# Altium project GenericLedDriver.PrjPcb
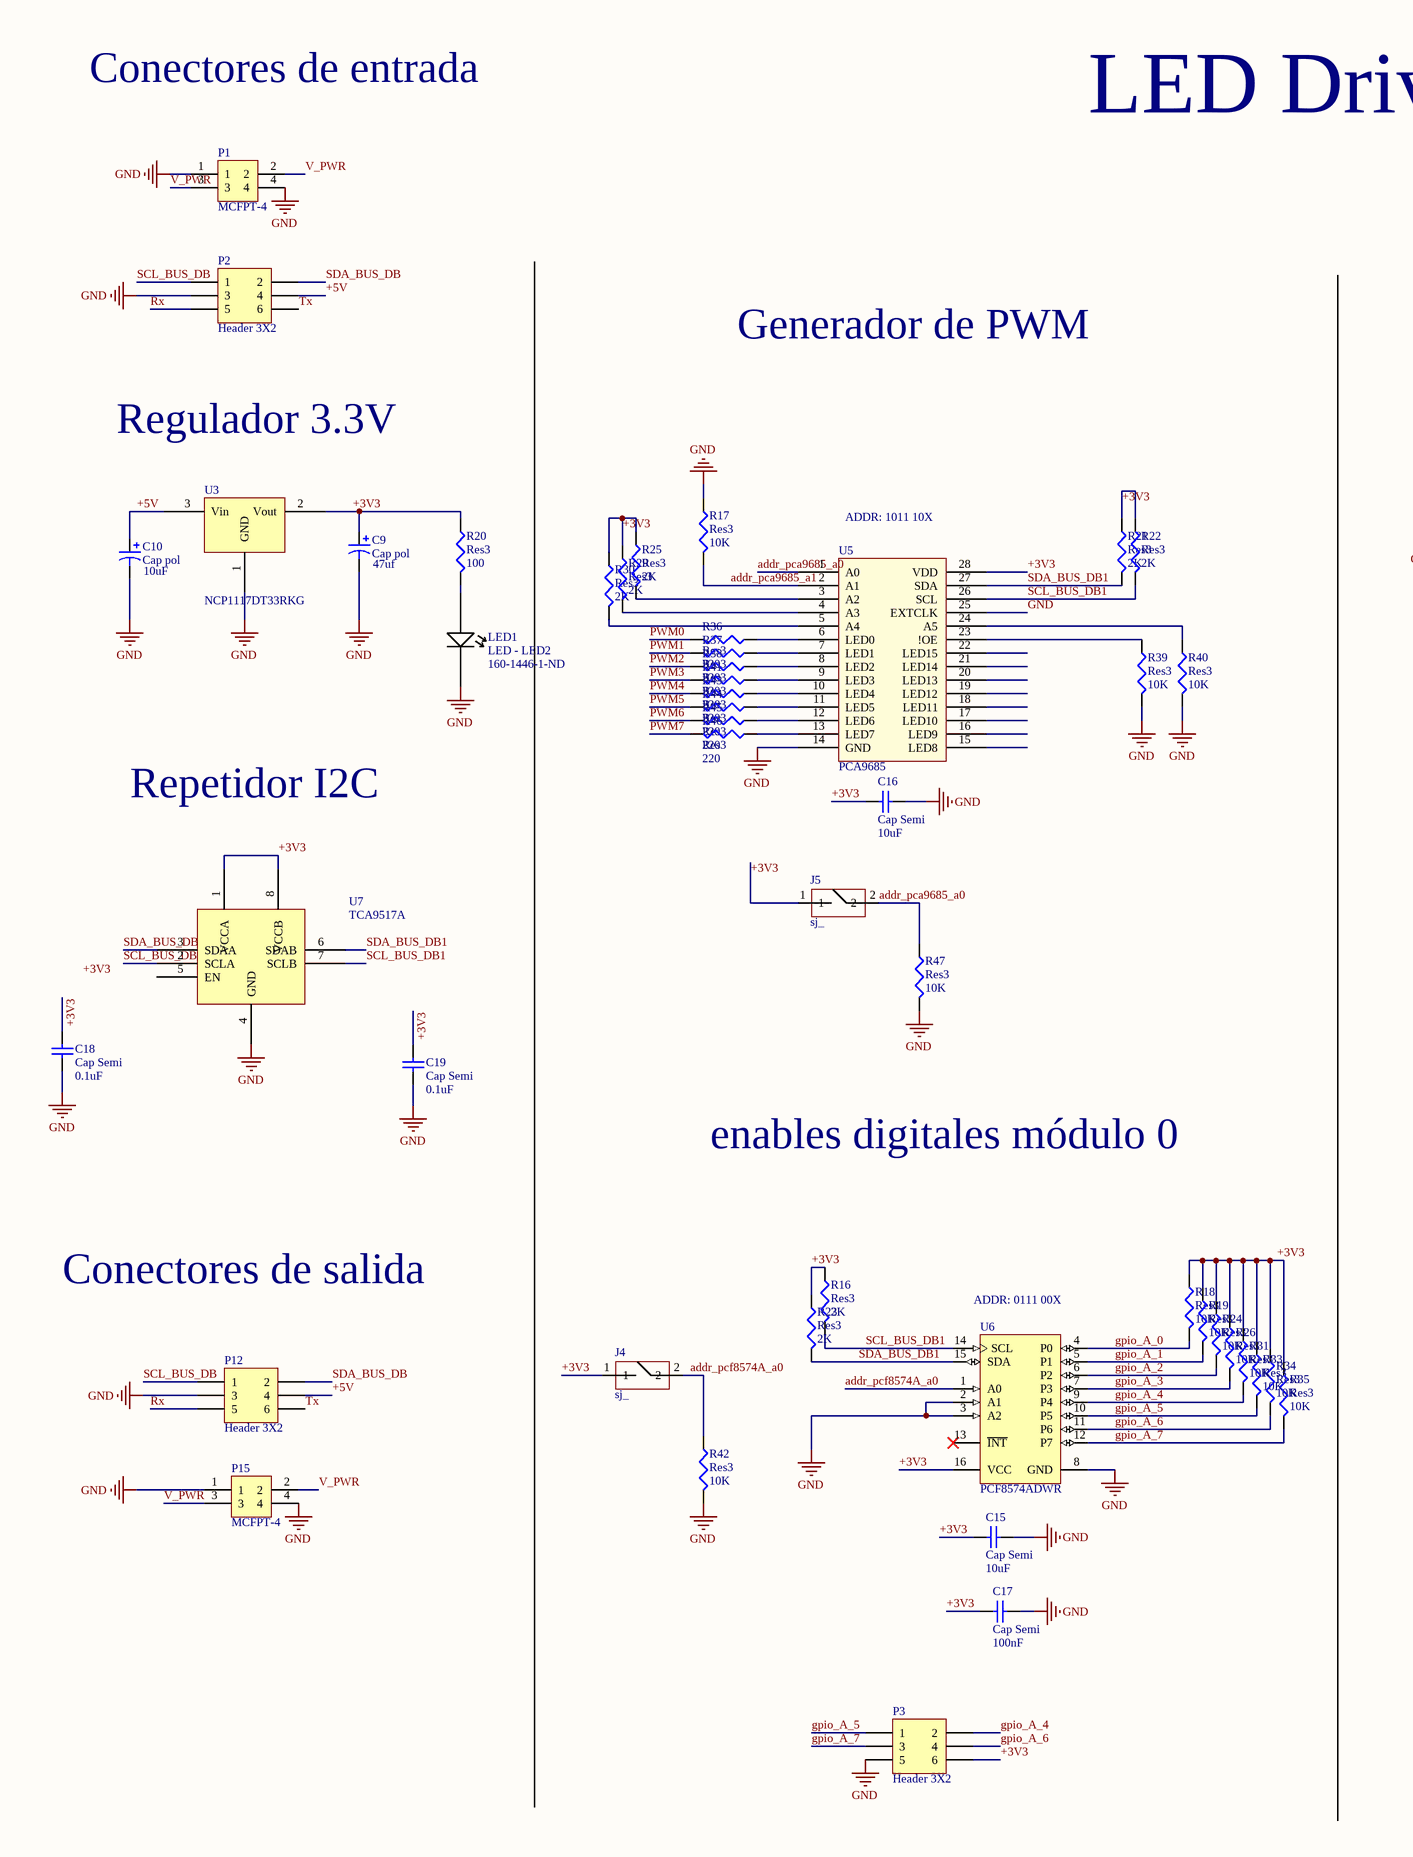
[diagram p0: main.SchDoc, left]
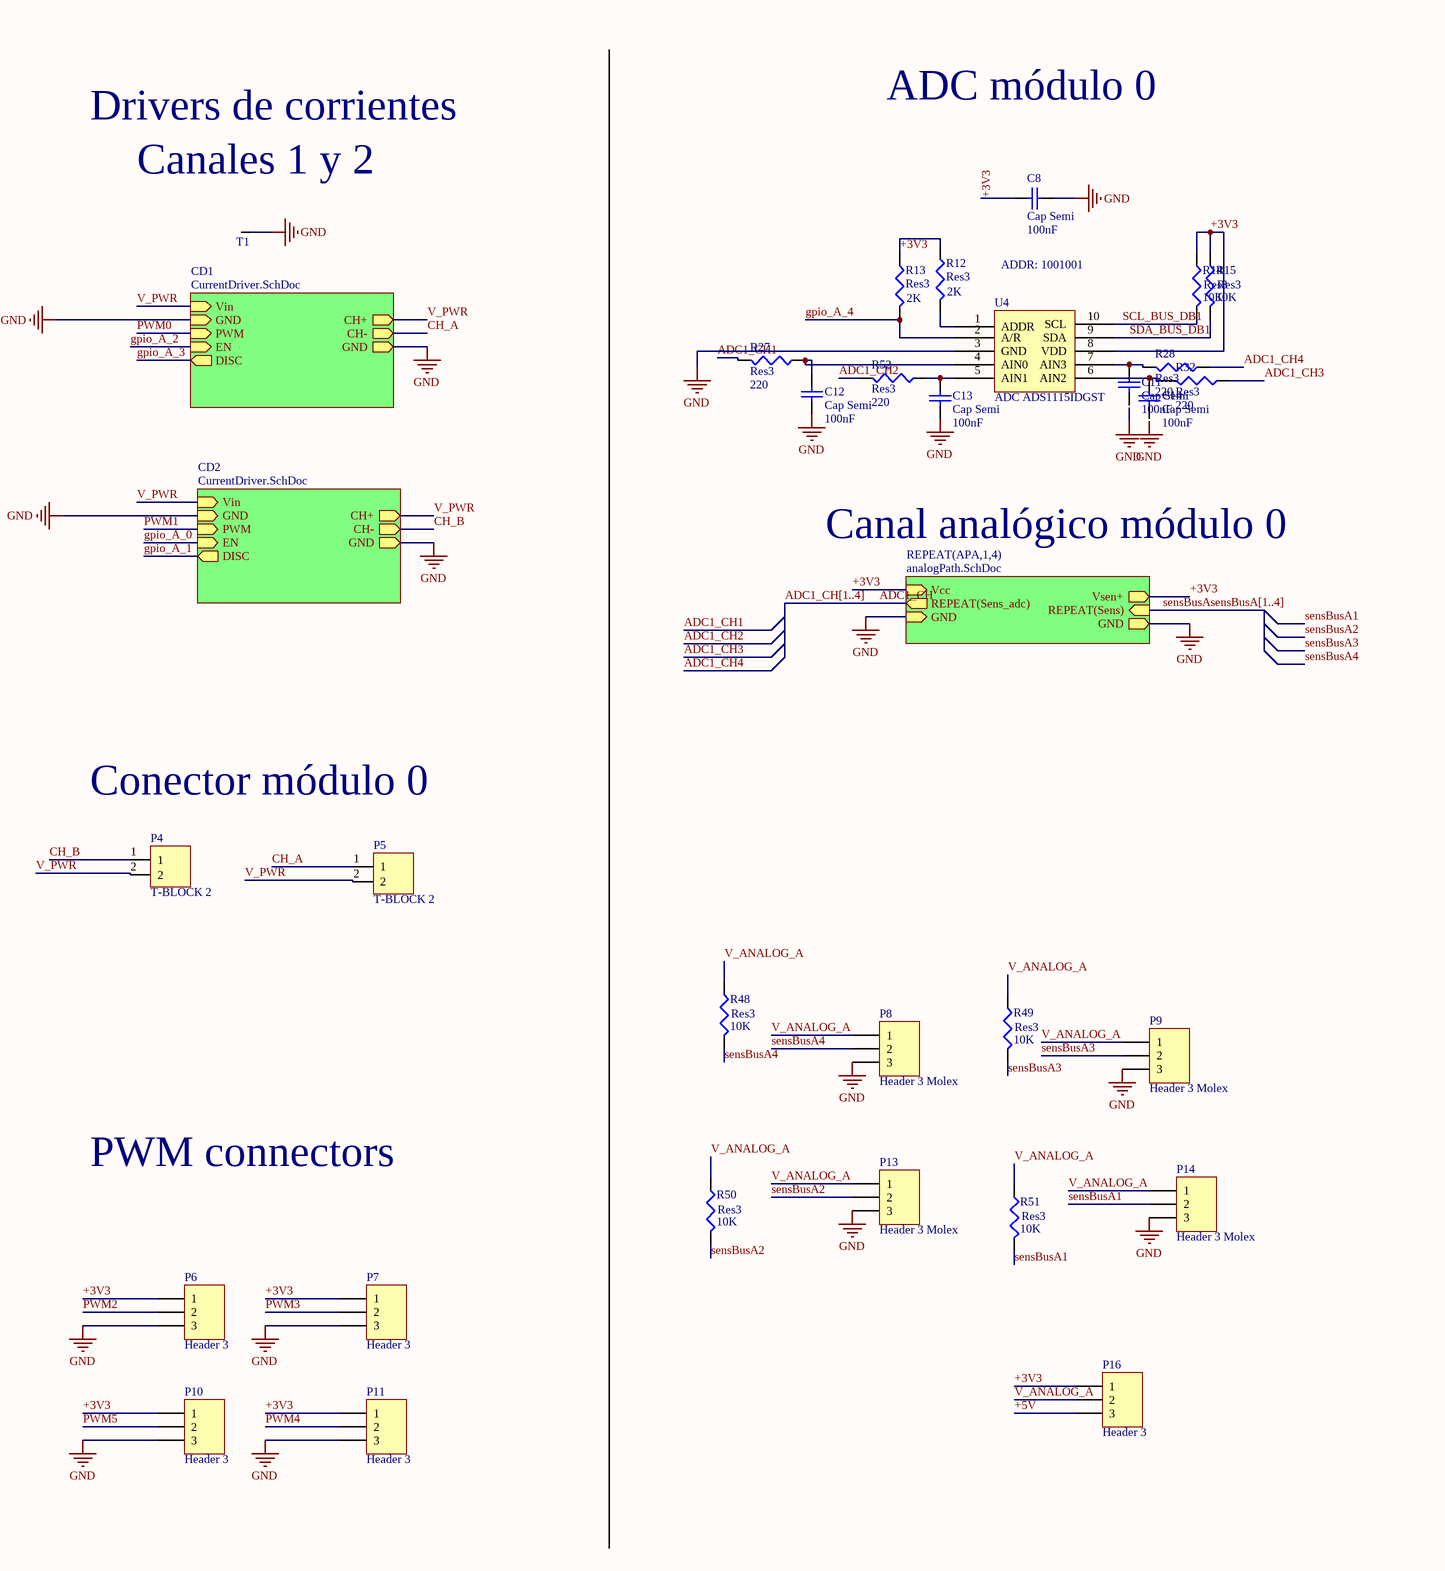
[diagram p1: main.SchDoc, right]
2 sheets, 90 parts. Net scope: hierarchical (ports join the sheet entries above them; power ports are global).
Board file: DriverBlueBoard.PcbDoc
Sheets:
  main.SchDoc
    CD1 = CurrentDriver.SchDoc
    CD2 = CurrentDriver.SchDoc

## Sheet main.SchDoc
size 558 x 381 mm

### Parts
C8  Cap Semi  value 100nF  [1608[0603]]
C9  Cap pol  value 47uf  [CAPEA-5.30x5.30]
C10  Cap pol  value 10uF  [CAPEA-4.30x4.30]
C11  Cap Semi  value 100nF  [1608[0603]]
C12  Cap Semi  value 100nF  [1608[0603]]
C13  Cap Semi  value 100nF  [1608[0603]]
C14  Cap Semi  value 100nF  [1608[0603]]
C15  Cap Semi  value 10uF  [1608[0603]]
C16  Cap Semi  value 10uF  [1608[0603]]
C17  Cap Semi  value 100nF  [1608[0603]]
C18  Cap Semi  value 0.1uF  [1608[0603]]
C19  Cap Semi  value 0.1uF  [1608[0603]]
J4  sj_  [JUMPER_NET_TIE]
J5  sj_  [JUMPER_NET_TIE]
LED1  LED - LED2  Supplier Part Number 1: 160-1446-1-ND  [LED]
P1  MCFPT-4  [MCFPT-4-VERT]
P2  Header 3X2  [HDR2X3]
P3  Header 3X2  [HDR2X3]
P4  T-BLOCK 2  [T-BLOCK_2_3MM]
P5  T-BLOCK 2  [T-BLOCK_2_3MM]
P6  Header 3  [HDR1X3]
P7  Header 3  [HDR1X3]
P8  Header 3 Molex  [HDR1X3]
P9  Header 3 Molex  [HDR1X3]
P10  Header 3  [HDR1X3]
P11  Header 3  [HDR1X3]
P12  Header 3X2  [HDR2X3]
P13  Header 3 Molex  [HDR1X3]
P14  Header 3 Molex  [HDR1X3]
P15  MCFPT-4  [MCFPT-4-VERT]
P16  Header 3  [HDR1X3]
R12  Res3  value 2K  [J1-0603]
R13  Res3  value 2K  [J1-0603]
R14  Res3  value 10K  [J1-0603]
R15  Res3  value 10K  [J1-0603]
R16  Res3  value 2K  [J1-0603]
R17  Res3  value 10K  [J1-0603]
R18  Res3  value 10K  [J1-0603]
R19  Res3  value 10K  [J1-0603]
R20  Res3  value 100  [J1-0603]
R21  Res3  value 2K  [J1-0603]
R22  Res3  value 2K  [J1-0603]
R23  Res3  value 2K  [J1-0603]
R24  Res3  value 10K  [J1-0603]
R25  Res3  value 2K  [J1-0603]
R26  Res3  value 10K  [J1-0603]
R27  Res3  value 220  [J1-0603]
R28  Res3  value 220  [J1-0603]
R29  Res3  value 2K  [J1-0603]
R30  Res3  value 2K  [J1-0603]
R31  Res3  value 10K  [J1-0603]
R32  Res3  value 220  [J1-0603]
R33  Res3  value 10K  [J1-0603]
R34  Res3  value 10K  [J1-0603]
R35  Res3  value 10K  [J1-0603]
R36  Res3  value 220  [J1-0603]
R37  Res3  value 220  [J1-0603]
R38  Res3  value 220  [J1-0603]
R39  Res3  value 10K  [J1-0603]
R40  Res3  value 10K  [J1-0603]
R41  Res3  value 220  [J1-0603]
R42  Res3  value 10K  [J1-0603]
R43  Res3  value 220  [J1-0603]
R44  Res3  value 220  [J1-0603]
R45  Res3  value 220  [J1-0603]
R46  Res3  value 220  [J1-0603]
R47  Res3  value 10K  [J1-0603]
R48  Res3  value 10K  [J1-0603]
R49  Res3  value 10K  [J1-0603]
R50  Res3  value 10K  [J1-0603]
R51  Res3  value 10K  [J1-0603]
R52  Res3  value 220  [J1-0603]
T1  TP - SMALL TP_1  [EXPOSED PAD]  (value not drawn)
U3  NCP1117DT33RKG  [DPAK]
U4  ADC ADS1115IDGST  [DGS10-L]
U5  PCA9685  [SSOP-28_L]
U6  PCF8574ADWR  [DW16_N]
U7  TCA9517A  [vssop-8]

### Sub-sheets
CD1 = CurrentDriver.SchDoc: Vin (in), PWM (in), EN (in), DISC (out), CH+ (out), CH- (out), GND (out), GND (in)
CD2 = CurrentDriver.SchDoc: Vin (in), PWM (in), EN (in), DISC (out), CH+ (out), CH- (out), GND (out), GND (in)
REPEAT(APA,1,4) = analogPath.SchDoc (file not in this document): REPEAT(Sens_adc) (out), Vcc (in), GND (in), Vsen+ (out), REPEAT(Sens) (in), GND (out)

### Nets
GND: C8.1 C9.2 C10.2 C12.2 C13.2 C15.1 C16.1 C17.1 C18.1 C19.1 LED1.2 P1.1 P1.4 P2.3 P3.5 P6.3 P7.3 P8.3 P9.3 P10.3 P11.3 P12.3 P13.3 P14.3 P15.1 P15.4 R17.2 R39.1 R40.1 R42.1 R47.1 T1.1 U3.1(GND) U4.3(GND) U5.14(GND) U5.25(EXTCLK) U6.2(A1) U6.3(A2) U6.8(GND) U7.4(GND) ; sheet CD1/GND, sheet CD1/GND, sheet CD2/GND, sheet CD2/GND, sheet REPEAT(APA,1,4)/GND, sheet REPEAT(APA,1,4)/GND  [project net EXP_PAD]
+3V3: C8.2 C9.1 C15.2 C16.2 C17.2 C18.2 C19.2 J4.1 J5.1 P3.6 P6.1 P7.1 P10.1 P11.1 P16.1 R12.1 R13.1 R14.2 R15.2 R16.1 R18.2 R19.2 R20.2 R21.1 R22.1 R23.1 R24.2 R25.1 R26.2 R29.1 R30.1 R31.2 R33.2 R34.2 R35.2 U3.2(Vout) U4.8(VDD) U5.28(VDD) U6.16(VCC) U7.1(VCCA) U7.8(VCCB) ; sheet REPEAT(APA,1,4)/Vcc, sheet REPEAT(APA,1,4)/Vsen+
+5V: C10.1 P2.4 P12.4 P16.3 U3.3(Vin)
ADC1_CH: sheet REPEAT(APA,1,4)/REPEAT(Sens_adc)
ADC1_CH1: R27.2
ADC1_CH2: R52.2
ADC1_CH3: R32.1
ADC1_CH4: R28.1
addr_pca9685_a0: J5.2 R47.2 U5.1(A0)
addr_pca9685_a1: R17.1 U5.2(A1)
addr_pcf8574A_a0: J4.2 R42.2 U6.1(A0)
CH_A: P5.1 ; sheet CD1/CH-  [project net CH-]
CH_B: P4.1 ; sheet CD2/CH-  [project net CH-]
gpio_A_0: R18.1 U6.4(P0) ; sheet CD2/EN  [project net EN]
gpio_A_1: R19.1 U6.5(P1) ; sheet CD2/DISC  [project net DISC]
gpio_A_2: R24.1 U6.6(P2) ; sheet CD1/EN  [project net EN]
gpio_A_3: R26.1 U6.7(P3) ; sheet CD1/DISC  [project net DISC]
gpio_A_4: P3.2 R13.2 R31.1 U4.2(A/R) U6.9(P4)
gpio_A_5: P3.1 R33.1 U6.10(P5)
gpio_A_6: P3.4 R34.1 U6.11(P6)
gpio_A_7: P3.3 R35.1 U6.12(P7)
PWM0: R36.2 ; sheet CD1/PWM  [project net PWM]
PWM1: R37.2 ; sheet CD2/PWM  [project net PWM]
PWM2: P6.2 R38.2
PWM3: P7.2 R41.2
PWM4: P11.2 R43.2
PWM5: P10.2 R44.2
PWM6: R45.2
PWM7: R46.2
Rx: P2.5 P12.5
SCL_BUS_DB: P2.1 P12.1 U7.2(SCLA)
SCL_BUS_DB1: R14.1 R16.2 R22.2 U4.10(SCL) U5.26(SCL) U6.14(SCL) U7.7(SCLB)
SDA_BUS_DB: P2.2 P12.2 U7.3(SDAA)
SDA_BUS_DB1: R15.1 R21.2 R23.2 U4.9(SDA) U5.27(SDA) U6.15(SDA) U7.6(SDAB)
sensBusA: sheet REPEAT(APA,1,4)/REPEAT(Sens)  [also labelled sensBusA[1..4]]
sensBusA1: P14.2 R51.1
sensBusA2: P13.2 R50.1
sensBusA3: P9.2 R49.1
sensBusA4: P8.2 R48.1
Tx: P2.6 P12.6
V_ANALOG_A: P8.1 P9.1 P13.1 P14.1 P16.2 R48.2 R49.2 R50.2 R51.2
V_PWR: P1.2 P1.3 P4.2 P5.2 P15.2 P15.3 ; sheet CD1/Vin, sheet CD1/CH+, sheet CD2/Vin, sheet CD2/CH+  [project net CH+]
NetC11_1: C11.1 R28.2 U4.7(AIN3)
NetC12_1: C12.1 R27.1 U4.4(AIN0)
NetC13_1: C13.1 R52.1 U4.5(AIN1)
NetC14_1: C14.1 R32.2 U4.6(AIN2)
NetLED1_1: LED1.1 R20.1
NetR12_2: R12.2 U4.1(ADDR)
NetR25_2: R25.2 U5.3(A2)
NetR29_2: R29.2 U5.4(A3)
NetR30_2: R30.2 U5.5(A4)
NetR36_1: R36.1 U5.6(LED0)
NetR37_1: R37.1 U5.7(LED1)
NetR38_1: R38.1 U5.8(LED2)
NetR39_2: R39.2 U5.23(!OE)
NetR40_2: R40.2 U5.24(A5)
NetR41_1: R41.1 U5.9(LED3)
NetR43_1: R43.1 U5.10(LED4)
NetR44_1: R44.1 U5.11(LED5)
NetR45_1: R45.1 U5.12(LED6)
NetR46_1: R46.1 U5.13(LED7)

Not connected (* = marked no-connect by the designer): C11 2; C14 2; U5 15(LED8) 16(LED9) 17(LED10) 18(LED11) 19(LED12) 20(LED13) 21(LED14) 22(LED15); U6 13(~{INT})*; U7 5(EN)

### Buses and harness runs
bus ADC1_CH[1..4]

### Notes on the sheet
- Conectores de entrada
- LED Driver
- Generador de PWM
- Drivers de corrientes
- ADC módulo 0
- Regulador 3.3V
- (near T1) Canales 1 y 2
- (near U5) ADDR: 1011 10X
- ADDR: 1001001
- Canal analógico módulo 0
- Repetidor I2C
- Conector módulo 0
- enables digitales módulo 0
- Conectores de salida
- (near U6) ADDR: 0111 00X
- PWM connectors
- Labels drawn without touching a wire or pin: +3V3, GND

### Library data of the parts
C8 C11-C19 = Cap Semi: Capacitor (Semiconductor SIM Model); Published: 8-Jun-2000; LatestRevisionDate: 29-May-2009; LatestRevisionNote: IPC-7351 Footprint Added.; PackageReference: C1206; Publisher: Altium Limited; PackageDescription: Chip Capacitor; Supplier 1: Digi-Key
  C8 C11-C14 C17: Supplier Part Number 1: 1276-1857-1-ND
  C15 C16: Supplier Part Number 1: 490-12538-1-ND
  C18 C19: Supplier Part Number 1: 1276-1005-1-ND
C9 C10 = Cap pol generic: Cap Generic; PackageDescription: 5.3mm; Supplier 1: Digi-key
  C9: Supplier Part Number 1: PCE3890CT-ND
  C10: Supplier Part Number 1: PCE3878CT-ND
J4 J5 = Jumper: solder jumper generic
P1 P15 = CON - MCFPT-4: POWER CONN; Supplier Part Number 1: WM1790-ND; Supplier 1: Digi-Key
P2 P3 P12 = Header 3X2: Header, 3-Pin, Dual row; LatestRevisionDate: 17-Jul-2002; LatestRevisionNote: Re-released for DXP Platform.; Publisher: Altium Limited
  P2: Supplier Part Number 1: WM8247-ND; Supplier 1: Digi-key
P4 P5 = T-BLOCK_2_3MM: TE Connectivity Buchanan Series 3.5mm Pitch Straight, PCB Terminal Block, Through Hole, 2 Way; Supplier 1: RSComponents; Supplier Part Number 1: 710-0444; pitch: 3.5mm
P6 P7 P10 P11 P16 = Header 3: Header, 3-Pin; LatestRevisionDate: 17-Jul-2002; LatestRevisionNote: Re-released for DXP Platform.; Publisher: Altium Limited
P8 P9 P13 P14 = Header 3 Molex: Header, 3-Pin; Generic Part Number: 22272031; LatestRevisionDate: 17-Jul-2002; LatestRevisionNote: Re-released for DXP Platform.; Publisher: Altium Limited; Supplier2: RS; Supplier2 Part Number: 483-8477; Supplier1 Part Number: WM4112-ND; Supplier1: DigiKey
R12-R52 = Res3: Resistor; Published: 8-Jun-2000; LatestRevisionDate: 29-May-2009; LatestRevisionNote: IPC-7351 Footprint Added.; PackageReference: J1-0603; Publisher: Altium Limited; PackageDescription: Chip Resistor; Supplier 1: Digi-Key
  R12 R13 R16 R21-R23 R25 R29 R30: Supplier Part Number 1: RNCP0603FTD2K00CT-ND
  R14 R15 R17-R19 R24 R26 R31 R33-R35 R39 R40 R42 R47-R51: Supplier Part Number 1: RHM10KADCT-ND‎
  R20: Supplier Part Number 1: P120DBCT-ND
  R27 R28 R32 R36-R38 R41 R43-R46 R52: Supplier Part Number 1: A130087CT-ND
T1 = TP - SMALL TP_1: Test Point
U3 = REG - NPC1117: Reg npc 1117 3.3 1A DPAk; Supplier 1: Digi-Key; Supplier Part Number 1: NCP1117DT33T5GOSCT-ND
U4 = ADC - ADS1115: ADC 16bits 4 channels; Supplier 1: Digi-Key; Supplier Part Number 1: 296-24934-1-ND
U5 = PCA9685: 16CHANNELS PWM DIM LED DRIVER I2C; Supplier 1: Digi-Key; Supplier Part Number 1: 568-11925-1-ND
U6 = PCF8574ADWR: Remote 8-Bit I/O Expander for I2C-Bus, 2.5 to 6.0 V, -40 to 85 degC, 16-pin SOIC (DW), Green (RoHS & no Sb/Br); Manufacturer: Texas Instruments; SubFamily: I2C IO Expander; Voltage Nodes(V): 5, 3.3; Interrupt Output: Yes; fSCLK(Max)(MHz): 0.1; VCC(Min)(V): 2.5; VCC(Max)(V): 6; Max Frequency(kHz): 100; I2C Address: 0111 xxx; # of I/Os: 8; DatasheetVersion: SCPS069D; PackageVersion: revG, Jan-2011; PackageReference: DW16; PackageDescription: 16-Pin Small Outline Integrated Circuit, 10.3 x 7.5 mm, Pitch 1.27 mm Pitch; Supplier 1: Digi-Key; Supplier Part Number 1: 296-13105-2-ND; Supplier 2: Digi-Key; Supplier Part Number 2: 296-13105-1-ND; Supplier 3: Digi-Key; Supplier Part Number 3: 296-13105-6-ND; Supplier 4: Newark; Supplier Part Number 4: 75C5233; Supplier 5: Mouser; Supplier Part Number 5: 595-PCF8574ADWR; Eco-Plan: Green (RoHS & no Sb/Br); Reset Input: No; Vcc range(V): 2.5 to 6.0; Push-Pull I/O Type: Yes; Mounting Technology: Surface Mount; PartNumber: PCF8574ADWR; Code_JEDEC: MS-013-AA; ComponentLink1Description: Datasheet; ComponentLink1URL: http://www.ti.com/general/docs/lit/getliterature.tsp?genericPartNumber=PCF8574A&fileType=pdf; ComponentLink2Description: Package Specification; ComponentLink2URL: http://www.ti.com/litv/pdf/msoi003g
U7 = TCA9517A: I2C BUS REPEATER; Supplier 1: Digi-Key; Supplier Part Number 1: 296-39220-1-ND
LED1 = LED - LED2: Supplier 1: Digi-Key

## Sheet CurrentDriver.SchDoc
size A
Used 2 times, as channels CD1, CD2. Parts and nets are listed once, with the designators drawn on the sheet.
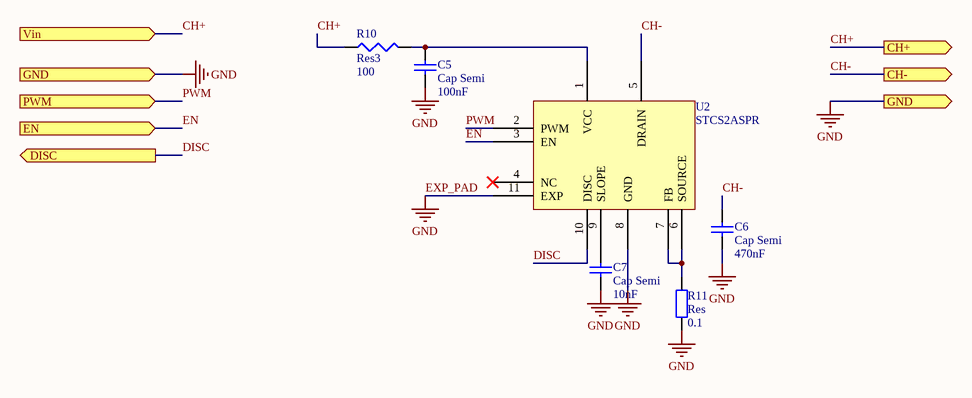
[diagram p2: CurrentDriver.SchDoc]

### Parts
C5  Cap Semi  value 100nF  [1608[0603]]
C6  Cap Semi  value 470nF  [1608[0603]]
C7  Cap Semi  value 10nF  [1608[0603]]
R10  Res3  value 100  [J1-0603]
R11  Res  value 0.1  [2512]
U2  STCS2ASPR  [PowerSO-10]

### Ports
CH+ (out), CH- (out), DISC (out), EN (in), GND (in), GND (out), PWM (in), Vin (in)

### Nets
EXP_PAD: C5.2 C6.2 C7.2 R11.1 U2.8(GND) U2.11(EXP) ; port GND  [also labelled GND]
CH+: R10.2 ; port Vin, port CH+
CH-: C6.1 U2.5(DRAIN) ; port CH-
DISC: U2.10(DISC) ; port DISC
EN: U2.3(EN) ; port EN
PWM: U2.2(PWM) ; port PWM
NetC5_1: C5.1 R10.1 U2.1(VCC)
NetC7_1: C7.1 U2.9(SLOPE)
NetR11_2: R11.2 U2.6(SOURCE) U2.7(FB)

Not connected (* = marked no-connect by the designer): U2 4(NC)*

### Channels
CD1: designators end in _CD1; ports CH+=CH+ CH-=CH- DISC=DISC EN=EN GND=EXP_PAD PWM=PWM Vin=CH+
CD2: designators end in _CD2; ports CH+=CH+ CH-=CH- DISC=DISC EN=EN GND=EXP_PAD PWM=PWM Vin=CH+

### Library data of the parts
C5-C7 = Cap Semi: Capacitor (Semiconductor SIM Model); Published: 8-Jun-2000; LatestRevisionDate: 29-May-2009; LatestRevisionNote: IPC-7351 Footprint Added.; PackageReference: C1206; Publisher: Altium Limited; PackageDescription: Chip Capacitor; Supplier 1: Digi-Key
  C5: Supplier Part Number 1: 1276-1857-1-ND
  C6: Supplier Part Number 1: 490-4775-1-ND
  C7: Supplier Part Number 1: 311-1360-1-ND
R10 = Res3: Resistor; Published: 8-Jun-2000; LatestRevisionDate: 29-May-2009; LatestRevisionNote: IPC-7351 Footprint Added.; PackageReference: J1-0603; Publisher: Altium Limited; PackageDescription: Chip Resistor; Supplier 1: Digi-Key; Supplier Part Number 1: P120DBCT-ND
R11 = Res: Generic resistor; Supplier 1: Digi-Key; Supplier Part Number 1: 311-0.1TCT-ND
U2 = STCS2A: LED CURRENT DRIVER; Supplier 1: Digi-Key; Supplier Part Number 1: 497-6917-1-ND

## Nets that join several sheets
EXP_PAD: main (40 pins), CD1 (6 pins), CD2 (6 pins)
CH+: main (6 pins), CD1 (R10_CD1.2), CD2 (R10_CD2.2)
CH-: main (P4.1), CD2 (C6_CD2.1 U2_CD2.5)
CH-: main (P5.1), CD1 (C6_CD1.1 U2_CD1.5)
DISC: main (R19.1 U6.5), CD2 (U2_CD2.10)
DISC: main (R26.1 U6.7), CD1 (U2_CD1.10)
EN: main (R18.1 U6.4), CD2 (U2_CD2.3)
EN: main (R24.1 U6.6), CD1 (U2_CD1.3)
PWM: main (R36.2), CD1 (U2_CD1.2)
PWM: main (R37.2), CD2 (U2_CD2.2)